# Altium project Environmental Sensor Shield.PrjPcb
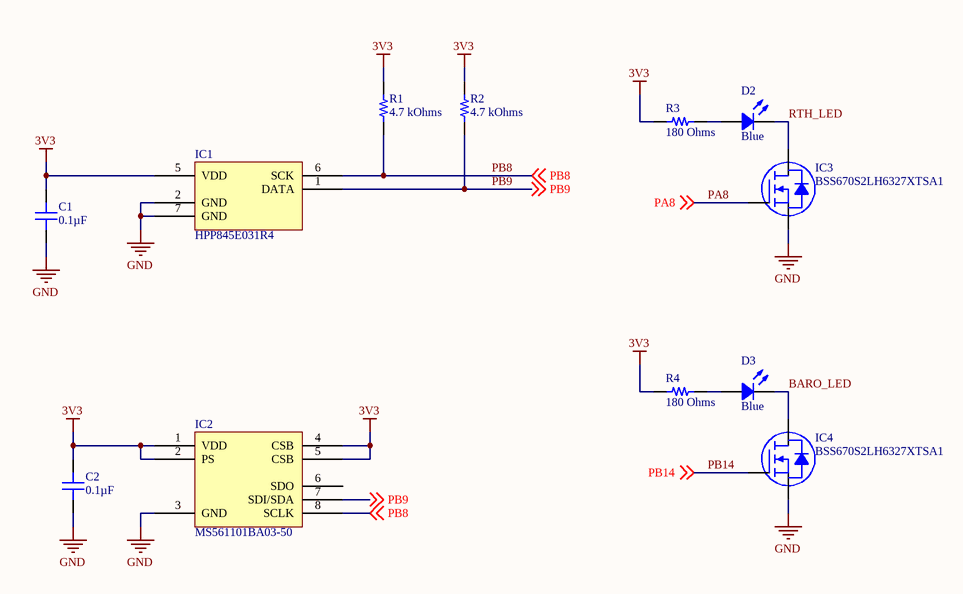
[diagram p0: Environmental Sensor.SchDoc]
3 sheets, 28 parts. Net scope: global (net labels, ports and power ports of the same name join across sheets).
Board file: Environmental Shield.PcbDoc
Sheets:
  Environmental Sensor.SchDoc
  Display Module.SchDoc
  Connectors.SchDoc

## Sheet Environmental Sensor.SchDoc: Environmental Sensor
size A4; SheetNumber: 1; SheetTotal: 3

### Parts
C1  0.1µF  [CAP 0603_1608]
C2  0.1µF  [CAP 0603_1608]
D2  Blue  [LED 0603_1608 BLUE]
D3  Blue  [LED 0603_1608 BLUE]
IC1  HPP845E031R4  [TE HPP845E031R4]
IC2  MS561101BA03-50  [MEAS SPEC MS5611-01BA03]
IC3  BSS670S2LH6327XTSA1  [INFINEON SOT-23-3]
IC4  BSS670S2LH6327XTSA1  [INFINEON SOT-23-3]
R1  4.7 kOhms  [RES 0603_1608]
R2  4.7 kOhms  [RES 0603_1608]
R3  180 Ohms  [RES 0603_1608]
R4  180 Ohms  [RES 0603_1608]

### Nets
3V3: C1.2 C2.2 IC1.5(VDD) IC2.1(VDD) IC2.2(PS) IC2.4(CSB) IC2.5(CSB) R1.2 R2.2 R3.1 R4.1
GND: C1.1 C2.1 IC1.2(GND) IC1.7(GND) IC2.3(GND) IC3.2(S) IC4.2(S)
BARO_LED: D3.2 IC4.3(D)
PA8: IC3.1(G) ; off-sheet PA8
PB8: IC1.6(SCK) IC2.8(SCLK) R1.1 ; off-sheet PB8
PB9: IC1.1(DATA) IC2.7(SDI/SDA) R2.1 ; off-sheet PB9
PB14: IC4.1(G) ; off-sheet PB14
RTH_LED: D2.2 IC3.3(D)
NetD2_1: D2.1 R3.2
NetD3_1: D3.1 R4.2

Not connected (* = marked no-connect by the designer): IC2 6(SDO)

### Notes on the sheet
- Title
- Size:
- Date:
- A4
- Number:
- Time:
- Revision:
- Sheet
- of
- File:

### Library data of the parts
C1 C2 = 06035C104JAT4A: CAP CER 0.1UF 50V X7R 0603; Manufacturer: AVX Corporation; Tolerance: ±5%; Part Number: 06035C104JAT4A; Value: 0.1µF; Applications: General Purpose; Capacitance: 0.1µF; ComponentLink1Description: Datasheet; ComponentLink1URL: http://datasheets.avx.com/X7RDielectric.pdf; ComponentLink2Description: DigiKey Link; ComponentLink2URL: http://digikey.com/product-detail/en/avx-corporation/06035C104JAT4A/478-12459-1-ND/9749311; Device Package: 0603 (1608 Metric); LastUpdated: 02/09/2020 01:03:34; Lifecycle Status: Active; Minimum Order: 1; Mounting Type: Surface Mount, MLCC; Operating Temperature: -55°C ~ 125°C; Package / Case: 0603 (1608 Metric); Packaging: TapeAndReel; PartId: 3002; Part Status: Active; Price: 0.01; Series: -; Size / Dimension: 0.063" L x 0.032" W (1.60mm x 0.81mm); Supplier 1: DigiKey; Supplier Part Number 1: 478-12459-1-ND; Temperature Coefficient: X7R; Thickness (Max): 0.035" (0.90mm); Voltage - Rated: 50V
D2 D3 = LTST-C193TBKT-5A: LED BLUE CLEAR CHIP SMD; Manufacturer: Lite-On Inc.; Configuration: Standard; Current - Test: 5mA; Lens Color: Colorless; Lens Size: 1.15mm x 0.80mm; Lens Style: Rectangle with Flat Top; Millicandela Rating: 15mcd; Viewing Angle: 130°; Voltage - Forward (Vf) (Typ): 2.8V; Wavelength - Dominant: 470nm; Wavelength - Peak: 468nm; Part Number: LTST-C193TBKT-5A; Color: Blue; ComponentLink1Description: Datasheet; ComponentLink1URL: //media.digikey.com/pdf/Data%20Sheets/Lite-On%20PDFs/LTST-C193TBKT-5A.pdf; ComponentLink2Description: DigiKey Link; ComponentLink2URL: http://digikey.com/product-detail/en/lite-on-inc/LTST-C193TBKT-5A/160-1827-1-ND/2355044; Device Package: 0603 (1608 Metric); Height (Max): 0.45mm; LastUpdated: 02/09/2020 01:20:25; Lens Transparency: Clear; Lifecycle Status: Active; Minimum Order: 1; Mounting Type: Surface Mount; Package / Case: 0603 (1608 Metric); Packaging: TapeAndReel; PartId: 829; Part Status: Active; Price: 0.06; Series: -; Size / Dimension: 1.60mm L x 0.80mm W; Supplier 1: DigiKey; Supplier Part Number 1: 160-1827-1-ND; Supplier Device Package: Chip LED; Value: Blue
IC1 = HPP845E031R4: SENSOR HUMID/TEMP 3V I2C 2% SMD; Manufacturer: TE Connectivity Measurement Specialties; Accuracy: ±2% RH; Humidity Range: 0 ~ 100% RH; Output: 12b; Output Type: I²C; Response Time: 5s; Sensor Type: Humidity, Temperature; Voltage - Supply: 1.5V ~ 3.6V; Part Number: HPP845E031R4; ComponentLink1Description: Datasheet; ComponentLink1URL: https://www.te.com/commerce/DocumentDelivery/DDEController?Action=srchrtrv&DocNm=HPC199_6&DocType=Data+Sheet&DocLang=English; ComponentLink2Description: DigiKey Link; ComponentLink2URL: http://digikey.com/product-detail/en/te-connectivity-measurement-specialties/HPP845E031R4/223-1144-1-ND/3945773; Device Package: 6-VDFN Exposed Pad; LastUpdated: 24/05/2020 22:55:13; Lifecycle Status: Active; Minimum Order: 1; Mounting Type: Surface Mount; Operating Temperature: -40°C ~ 125°C; Package / Case: 6-VDFN Exposed Pad; Packaging: TapeAndReel; Part Status: Active; Price: 2.87; Series: HTU; Supplier 1: DigiKey; Supplier Part Number 1: 223-1144-1-ND; Supplier Device Package: 6-DFN (3x3)
IC2 = MS561101BA03-50: BAROMETRIC PRESSURE SENSOR; Manufacturer: TE Connectivity Measurement Specialties; Accuracy: ±0.022PSI (±0.15kPa); Maximum Pressure: 87.02PSI (600kPa); Operating Pressure: 0.15PSI ~ 17.4PSI (1kPa ~ 120kPa); Output: 24 b; Output Type: I²C, SPI; Port Style: No Port; Pressure Type: Absolute; Voltage - Supply: 1.8V ~ 3.6V; Part Number: MS561101BA03-50; Applications: Board Mount; ComponentLink1Description: Datasheet; ComponentLink1URL: https://www.te.com/commerce/DocumentDelivery/DDEController?Action=srchrtrv&DocNm=MS5611-01BA03&DocType=Data+Sheet&DocLang=English; ComponentLink2Description: DigiKey Link; ComponentLink2URL: http://digikey.com/product-detail/en/te-connectivity-measurement-specialties/MS561101BA03-50/223-1622-1-ND/5277638; Device Package: 8-SMD; LastUpdated: 20/04/2020 15:54:53; Lifecycle Status: Active; Minimum Order: 1; Operating Temperature: -40°C ~ 85°C; Package / Case: 8-SMD; Packaging: Unknown; Part Status: Active; Price: 6.37; Series: -; Supplier 1: DigiKey; Supplier Part Number 1: 223-1622-1-ND; Termination Style: SMD (SMT) Tab
IC3 IC4 = BSS670S2LH6327XTSA1: MOSFET N-CH 55V 540MA SOT23; Manufacturer: Infineon Technologies; Current - Continuous Drain (Id) @ 25°C: 540mA (Ta); Drive Voltage (Max Rds On,  Min Rds On): 4.5V, 10V; FET Type: N-Channel; Gate Charge (Qg) (Max) @ Vgs: 2.26nC @ 10V; Input Capacitance (Ciss) (Max) @ Vds: 75pF @ 25V; Power Dissipation (Max): 360mW (Ta); Rds On (Max) @ Id, Vgs: 650mOhm @ 270mA, 10V; Vgs (Max): ±20V; Vgs(th) (Max) @ Id: 2V @ 2.7µA; Part Number: BSS670S2LH6327XTSA1; ComponentLink1Description: Datasheet; ComponentLink1URL: https://www.infineon.com/dgdl/BSS670S2L_Rev2.5.pdf?folderId=db3a3043156fd573011622e10b5c1f67&fileId=db3a304330f68606013109e4a7fb0094; ComponentLink2Description: DigiKey Link; ComponentLink2URL: http://digikey.com/product-detail/en/infineon-technologies/BSS670S2LH6327XTSA1/BSS670S2LH6327XTSA1CT-ND/3196653; Drain to Source Voltage (Vdss): 55V; LastUpdated: 02/09/2020 01:25:05; Lifecycle Status: Active; Minimum Order: 1; Mounting Type: Surface Mount; Operating Temperature: -55°C ~ 150°C (TJ); Package / Case: TO-236-3, SC-59, SOT-23-3; Packaging: TapeAndReel; Part Status: Active; Price: 0.07; Series: OptiMOS™; Supplier 1: DigiKey; Supplier Part Number 1: BSS670S2LH6327XTSA1CT-ND; Supplier Device Package: SOT-23-3; Technology: MOSFET (Metal Oxide)
R1 R2 = ERJ-3EKF4701V: RES SMD 4.7K OHM 1% 1/10W 0603; Manufacturer: Panasonic Electronic Components; Power (Watts): 0.1W, 1/10W; Temperature Coefficient: ±100ppm/°C; Part Number: ERJ-3EKF4701V; Value: 4.7 kOhms; ComponentLink1Description: Datasheet; ComponentLink1URL: https://industrial.panasonic.com/cdbs/www-data/pdf/RDA0000/AOA0000C304.pdf; ComponentLink2Description: DigiKey Link; ComponentLink2URL: http://digikey.com/product-detail/en/panasonic-electronic-components/ERJ-3EKF4701V/P4.70KHCT-ND/1746782; Composition: Thick Film; Device Package: 0603 (1608 Metric); Features: Automotive AEC-Q200; Height - Seated (Max): 0.022" (0.55mm); LastUpdated: 02/09/2020 01:10:23; Lifecycle Status: Active; Minimum Order: 1; Number of Terminations: 2; Operating Temperature: -55°C ~ 155°C; Package / Case: 0603 (1608 Metric); Packaging: TapeAndReel; PartId: 5645; Part Status: Active; Price: 0.01; Ratings: AEC-Q200; Resistance: 4.7 kOhms; Series: ERJ; Size / Dimension: 0.063" L x 0.031" W (1.60mm x 0.80mm); Supplier 1: DigiKey; Supplier Part Number 1: P4.70KHCT-ND; Supplier Device Package: 0603; Tolerance: ±1%
R3 R4 = ERJ-PA3J181V: RES SMD 180 OHM 5% 1/4W 0603; Manufacturer: Panasonic Electronic Components; Power (Watts): 0.25W, 1/4W; Temperature Coefficient: ±200ppm/°C; Part Number: ERJ-PA3J181V; Value: 180 Ohms; ComponentLink1Description: Datasheet; ComponentLink1URL: https://industrial.panasonic.com/cdbs/www-data/pdf/RDO0000/AOA0000C331.pdf; ComponentLink2Description: DigiKey Link; ComponentLink2URL: http://digikey.com/product-detail/en/panasonic-electronic-components/ERJ-PA3J181V/P180BZCT-ND/5036266; Composition: Thick Film; Device Package: 0603 (1608 Metric); Features: Automotive AEC-Q200, Pulse Withstanding; Height - Seated (Max): 0.022" (0.55mm); LastUpdated: 02/09/2020 01:09:49; Lifecycle Status: Active; Minimum Order: 1; Number of Terminations: 2; Operating Temperature: -55°C ~ 155°C; Package / Case: 0603 (1608 Metric); Packaging: TapeAndReel; PartId: 21551; Part Status: Active; Price: 0.01; Ratings: AEC-Q200; Resistance: 180 Ohms; Series: ERJ; Size / Dimension: 0.063" L x 0.031" W (1.60mm x 0.80mm); Supplier 1: DigiKey; Supplier Part Number 1: P180BZCT-ND; Supplier Device Package: 0603; Tolerance: ±5%

## Sheet Display Module.SchDoc: Display
size A4; SheetNumber: 2; SheetTotal: 3
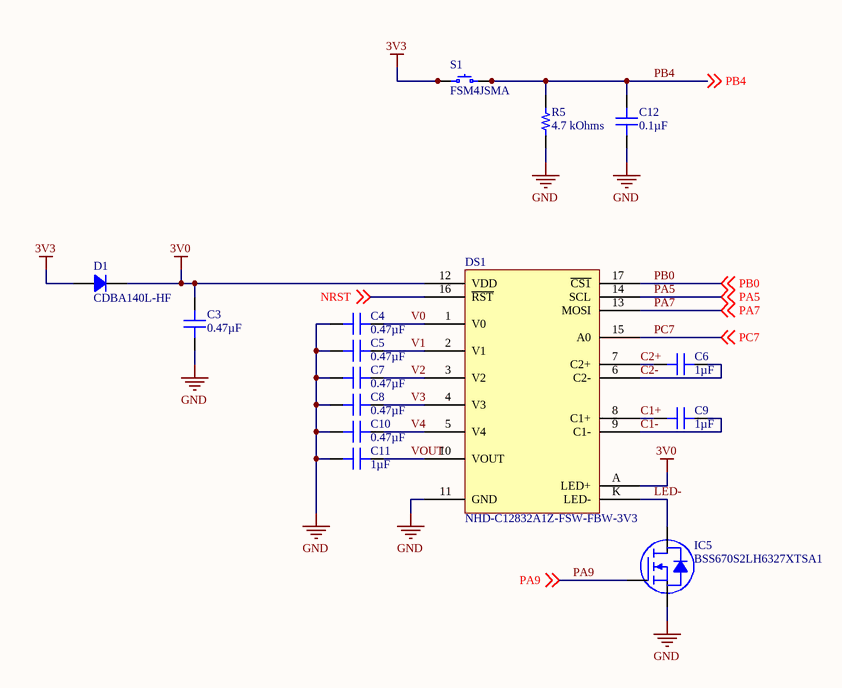
[diagram p1: Display Module.SchDoc]

### Parts
C3  0.47µF  [CAP 0603_1608]
C4  0.47µF  [CAP 0603_1608]
C5  0.47µF  [CAP 0603_1608]
C6  1µF  [CAP 0603_1608]
C7  0.47µF  [CAP 0603_1608]
C8  0.47µF  [CAP 0603_1608]
C9  1µF  [CAP 0603_1608]
C10  0.47µF  [CAP 0603_1608]
C11  1µF  [CAP 0603_1608]
C12  0.1µF  [CAP 0603_1608]
D1  CDBA140L-HF  [DO214AC SMA]
DS1  NHD-C12832A1Z-FSW-FBW-3V3  [NHD-C12832A1Z WHITE]
IC5  BSS670S2LH6327XTSA1  [INFINEON SOT-23-3]
R5  4.7 kOhms  [RES 0603_1608]
S1  FSM4JSMA  [TE FSM4JSMA]

### Nets
3V0: C3.1 D1.2 DS1.12(VDD) DS1.A(LED+)
3V3: D1.1 S1.1 S1.2
GND: C3.2 C4.2 C5.2 C7.2 C8.2 C10.2 C11.1 C12.1 DS1.11(GND) IC5.2(S) R5.1
C1+: C9.1 DS1.8(C1+)
C1-: C9.2 DS1.9(C1-)
C2+: C6.1 DS1.7(C2+)
C2-: C6.2 DS1.6(C2-)
LED-: DS1.K(LED-) IC5.3(D)
NRST: DS1.16(~{RST}) ; off-sheet NRST
PA5: DS1.14(SCL) ; off-sheet PA5
PA7: DS1.13(MOSI) ; off-sheet PA7
PA9: IC5.1(G) ; off-sheet PA9
PB0: DS1.17(~{CS1}) ; off-sheet PB0
PB4: C12.2 R5.2 S1.3 S1.4 ; off-sheet PB4
PC7: DS1.15(A0) ; off-sheet PC7
V0: C4.1 DS1.1(V0)
V1: C5.1 DS1.2(V1)
V2: C7.1 DS1.3(V2)
V3: C8.1 DS1.4(V3)
V4: C10.1 DS1.5(V4)
VOUT: C11.2 DS1.10(VOUT)

### Notes on the sheet
- Title
- Size:
- Date:
- A4
- Number:
- Time:
- Revision:
- Sheet
- of
- File:

### Library data of the parts
C3-C5 C7 C8 C10 = 0603B474K100CT: CAP CER 0.47UF 10V X7R 0603; Manufacturer: Walsin Technology Corporation; Tolerance: ±10%; Part Number: 0603B474K100CT; Value: 0.47µF; Applications: General Purpose; Capacitance: 0.47µF; ComponentLink1Description: Datasheet; ComponentLink1URL: http://www.passivecomponent.com/wp-content/uploads/2018/10/MLCC.pdf; ComponentLink2Description: DigiKey Link; ComponentLink2URL: http://digikey.com/product-detail/en/walsin-technology-corporation/0603B474K100CT/1292-1450-1-ND/9355454; Device Package: 0603 (1608 Metric); LastUpdated: 02/09/2020 01:03:16; Lifecycle Status: Active; Minimum Order: 1; Mounting Type: Surface Mount, MLCC; Operating Temperature: -55°C ~ 125°C; Package / Case: 0603 (1608 Metric); Packaging: TapeAndReel; PartId: 13392; Part Status: Active; Price: 0.01; Series: -; Size / Dimension: 0.063" L x 0.031" W (1.60mm x 0.80mm); Supplier 1: DigiKey; Supplier Part Number 1: 1292-1450-1-ND; Temperature Coefficient: X7R; Thickness (Max): 0.037" (0.95mm); Voltage - Rated: 10V
C6 C9 C11 = LMK107B7105KA-T: CAP CER 1UF 10V X7R 0603; Manufacturer: Taiyo Yuden; Tolerance: ±10%; Part Number: LMK107B7105KA-T; Value: 1µF; Applications: General Purpose; Capacitance: 1µF; ComponentLink1Description: Datasheet; ComponentLink1URL: https://www.yuden.co.jp/productdata/catalog/mlcc01_e.pdf; ComponentLink2Description: DigiKey Link; ComponentLink2URL: http://digikey.com/product-detail/en/taiyo-yuden/LMK107B7105KA-T/587-1242-1-ND/931019; Device Package: 0603 (1608 Metric); LastUpdated: 02/09/2020 01:03:30; Lifecycle Status: Active; Minimum Order: 1; Mounting Type: Surface Mount, MLCC; Operating Temperature: -55°C ~ 125°C; Package / Case: 0603 (1608 Metric); Packaging: TapeAndReel; PartId: 5525; Part Status: Active; Price: 0.01; Series: M; Size / Dimension: 0.063" L x 0.031" W (1.60mm x 0.80mm); Supplier 1: DigiKey; Supplier Part Number 1: 587-1242-1-ND; Temperature Coefficient: X7R; Thickness (Max): 0.035" (0.90mm); Voltage - Rated: 10V
C12 = 06035C104JAT4A: as C1 on sheet Environmental Sensor; Part Number: 06035C104JAT4A; Value: 0.1µF; Applications: General Purpose; Capacitance: 0.1µF; ComponentLink1Description: Datasheet; ComponentLink1URL: http://datasheets.avx.com/X7RDielectric.pdf; ComponentLink2Description: DigiKey Link; ComponentLink2URL: http://digikey.com/product-detail/en/avx-corporation/06035C104JAT4A/478-12459-1-ND/9749311; Device Package: 0603 (1608 Metric); LastUpdated: 02/09/2020 01:03:34; Lifecycle Status: Active; Minimum Order: 1; Mounting Type: Surface Mount, MLCC; Operating Temperature: -55°C ~ 125°C; Package / Case: 0603 (1608 Metric); Packaging: TapeAndReel; PartId: 3002; Part Status: Active; Price: 0.01; Series: -; Size / Dimension: 0.063" L x 0.032" W (1.60mm x 0.81mm); Supplier 1: DigiKey; Supplier Part Number 1: 478-12459-1-ND; Temperature Coefficient: X7R; Thickness (Max): 0.035" (0.90mm); Voltage - Rated: 50V
D1 = CDBA140L-HF: DIODE SCHOTTKY 40V 1A DO214AC; Manufacturer: Comchip Technology; Capacitance @ Vr, F: 130pF @ 4V, 1MHz; Current - Reverse Leakage @ Vr: 1mA @ 40V; Speed: Fast Recovery =< 500ns, > 200mA (Io); Voltage - Forward (Vf) (Max) @ If: 400mV @ 1A; Part Number: CDBA140L-HF; ComponentLink1Description: Datasheet; ComponentLink1URL: http://www.comchiptech.com/admin/files/product/CDBA140L-HF RevC513944.pdf; ComponentLink2Description: DigiKey Link; ComponentLink2URL: http://digikey.com/product-detail/en/comchip-technology/CDBA140L-HF/641-1691-1-ND/5226074; Current - Average Rectified (Io): 1A; Diode Type: Schottky; LastUpdated: 02/09/2020 01:19:02; Lifecycle Status: Active; Minimum Order: 1; Mounting Type: Surface Mount; Operating Temperature - Junction: -50°C ~ 100°C; Package / Case: DO-214AC, SMA; Packaging: TapeAndReel; PartId: 2148; Part Status: Active; Price: 0.10; Series: -; Supplier 1: DigiKey; Supplier Part Number 1: 641-1691-1-ND; Supplier Device Package: DO-214AC (SMA); Voltage - DC Reverse (Vr) (Max): 40V
DS1 = NHD-C12832A1Z-FSW-FBW-3V3: LCD COG GRAPHIC 128X32; Manufacturer: Newhaven Display Intl; Background Color: White (Black - Inverted); Backlight: LED - White; Display Mode: Transflective; Display Type: FSTN - Film Super-Twisted Nematic; Interface: SPI; Viewing Area: 36.00mm W x 12.00mm H; Part Number: NHD-C12832A1Z-FSW-FBW-3V3; ComponentLink1Description: Datasheet; ComponentLink1URL: http://www.newhavendisplay.com/specs/NHD-C12832A1Z-FSW-FBW-3V3.pdf; ComponentLink2Description: DigiKey Link; ComponentLink2URL: //digikey.com/product-detail/en/newhaven-display-intl/NHD-C12832A1Z-FSW-FBW-3V3/NHD-C12832A1Z-FSW-FBW-3V3-ND/2059236; LastUpdated: 04/12/2019 12:49:03; Lifecycle Status: 0; Minimum Order: 1; Packaging: Unknown; PartId: 1; Part Status: Active; Price: 11.53; Series: -; Supplier 1: DigiKey; Supplier Part Number 1: NHD-C12832A1Z-FSW-FBW-3V3-ND
IC5 = BSS670S2LH6327XTSA1: as IC3 on sheet Environmental Sensor; Part Number: BSS670S2LH6327XTSA1; ComponentLink1Description: Datasheet; ComponentLink1URL: https://www.infineon.com/dgdl/BSS670S2L_Rev2.5.pdf?folderId=db3a3043156fd573011622e10b5c1f67&fileId=db3a304330f68606013109e4a7fb0094; ComponentLink2Description: DigiKey Link; ComponentLink2URL: http://digikey.com/product-detail/en/infineon-technologies/BSS670S2LH6327XTSA1/BSS670S2LH6327XTSA1CT-ND/3196653; Drain to Source Voltage (Vdss): 55V; LastUpdated: 02/09/2020 01:25:05; Lifecycle Status: Active; Minimum Order: 1; Mounting Type: Surface Mount; Operating Temperature: -55°C ~ 150°C (TJ); Package / Case: TO-236-3, SC-59, SOT-23-3; Packaging: TapeAndReel; Part Status: Active; Price: 0.07; Series: OptiMOS™; Supplier 1: DigiKey; Supplier Part Number 1: BSS670S2LH6327XTSA1CT-ND; Supplier Device Package: SOT-23-3; Technology: MOSFET (Metal Oxide)
R5 = ERJ-3EKF4701V: as R1 on sheet Environmental Sensor; Part Number: ERJ-3EKF4701V; Value: 4.7 kOhms; ComponentLink1Description: Datasheet; ComponentLink1URL: https://industrial.panasonic.com/cdbs/www-data/pdf/RDA0000/AOA0000C304.pdf; ComponentLink2Description: DigiKey Link; ComponentLink2URL: http://digikey.com/product-detail/en/panasonic-electronic-components/ERJ-3EKF4701V/P4.70KHCT-ND/1746782; Composition: Thick Film; Device Package: 0603 (1608 Metric); Features: Automotive AEC-Q200; Height - Seated (Max): 0.022" (0.55mm); LastUpdated: 02/09/2020 01:10:23; Lifecycle Status: Active; Minimum Order: 1; Number of Terminations: 2; Operating Temperature: -55°C ~ 155°C; Package / Case: 0603 (1608 Metric); Packaging: TapeAndReel; PartId: 5645; Part Status: Active; Price: 0.01; Ratings: AEC-Q200; Resistance: 4.7 kOhms; Series: ERJ; Size / Dimension: 0.063" L x 0.031" W (1.60mm x 0.80mm); Supplier 1: DigiKey; Supplier Part Number 1: P4.70KHCT-ND; Supplier Device Package: 0603; Tolerance: ±1%
S1 = FSM4JSMA: SWITCH TACTILE SPST-NO 0.05A 24V; Manufacturer: TE Connectivity ALCOSWITCH Switches; Actuator Height off PCB, Vertical: 5.00mm; Actuator Orientation: Top Actuated; Actuator Type: Standard; Contact Rating @ Voltage: 0.05A @ 24VDC; Illumination: Non-Illuminated; Operating Force: 160gf; Outline: 6.00mm x 6.00mm; Switch Function: Off-Mom; Part Number: FSM4JSMA; Circuit: SPST-NO; ComponentLink1Description: Datasheet; ComponentLink1URL: https://www.te.com/commerce/DocumentDelivery/DDEController?Action=srchrtrv&DocNm=1308111-1_SWITCHES_CORE_PROGRAM_CATALOG&DocType=CS&DocLang=English; ComponentLink2Description: DigiKey Link; ComponentLink2URL: http://digikey.com/product-detail/en/te-connectivity-alcoswitch-switches/FSM4JSMA/450-1129-ND/525821; LastUpdated: 02/09/2020 01:27:07; Lifecycle Status: Active; Minimum Order: 1; Mounting Type: Surface Mount; Operating Temperature: -35°C ~ 85°C; Packaging: Bulk; Part Status: Active; Price: 0.23; Series: FSMJSMA; Supplier 1: DigiKey; Supplier Part Number 1: 450-1129-ND; Termination Style: Gull Wing

## Sheet Connectors.SchDoc
size A4; SheetNumber: 3; SheetTotal: 3
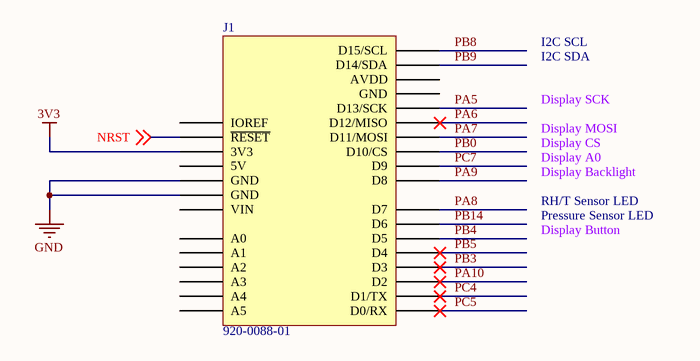
[diagram p2: Connectors.SchDoc]

### Parts
J1  920-0088-01  [SCHMARTBOARD - 920-0088-01]

### Nets
3V3: J1.4(3V3)
GND: J1.6(GND) J1.7(GND)
NRST: J1.3(~{RESET}) ; off-sheet NRST
PA5: J1.28(D13/SCK)
PA6: J1.27(D12/MISO)
PA7: J1.26(D11/MOSI)
PA8: J1.22(D7)
PA9: J1.23(D8)
PA10: J1.17(D2)
PB0: J1.25(D10/CS)
PB3: J1.18(D3)
PB4: J1.20(D5)
PB5: J1.19(D4)
PB8: J1.32(D15/SCL)
PB9: J1.31(D14/SDA)
PB14: J1.21(D6)
PC4: J1.16(D1/TX)
PC5: J1.15(D0/RX)
PC7: J1.24(D9)

Not connected (* = marked no-connect by the designer): J1 2(IOREF) 5(5V) 8(VIN) 9(A0) 10(A1) 11(A2) 12(A3) 13(A4) 14(A5) 29(GND) 30(AVDD)

### Notes on the sheet
- I2C SCL
- I2C SDA
- Display CS
- Display SCK
- Display MOSI
- Display A0
- Pressure Sensor LED
- Display Button
- Display Backlight
- RH/T Sensor LED

### Library data of the parts
J1 = 920-0088-01: CONN HDR 8/10P 0.1 GOLD PCB 6PC; Manufacturer: Schmartboard, Inc.; Connector Type: Header; Contact Length - Post: 0.413" (10.50mm); Number of Positions: 6, 8, 10; Number of Positions Loaded: All; Pitch - Mating: 0.100" (2.54mm); Style: Board to Board; System: Connector; Part Number: 920-0088-01; ComponentLink1Description: Datasheet; ComponentLink1URL: http://schmartboard.com/content/Brochures/920-0088-01.pdf; ComponentLink2Description: DigiKey Link; ComponentLink2URL: http://digikey.com/product-detail/en/schmartboard-inc/920-0088-01/1988-1036-ND/9559319; Contact Finish - Mating: Gold; Contact Finish - Post: Gold; Contact Type: Female Socket; Fastening Type: Push-Pull; Insulation Color: Black; Insulation Height: 0.335" (8.51mm); LastUpdated: 31/01/2020 20:49:58; Lifecycle Status: Active; Minimum Order: 1; Mounting Type: Through Hole; Number of Rows: 1; Packaging: Bulk; Part Status: Active; Price: 5.00; Series: -; Supplier 1: DigiKey; Supplier Part Number 1: 1988-1036-ND; Termination: Solder

## Nets that join several sheets
3V3: Environmental Sensor (11 pins), Display Module (D1.1 S1.1 S1.2), Connectors (J1.4)
GND: Environmental Sensor (7 pins), Display Module (11 pins), Connectors (J1.6 J1.7)
NRST: Display Module (DS1.16), Connectors (J1.3)
PA5: Display Module (DS1.14), Connectors (J1.28)
PA7: Display Module (DS1.13), Connectors (J1.26)
PA8: Environmental Sensor (IC3.1), Connectors (J1.22)
PA9: Display Module (IC5.1), Connectors (J1.23)
PB0: Display Module (DS1.17), Connectors (J1.25)
PB4: Display Module (C12.2 R5.2 S1.3 S1.4), Connectors (J1.20)
PB8: Environmental Sensor (IC1.6 IC2.8 R1.1), Connectors (J1.32)
PB9: Environmental Sensor (IC1.1 IC2.7 R2.1), Connectors (J1.31)
PB14: Environmental Sensor (IC4.1), Connectors (J1.21)
PC7: Display Module (DS1.15), Connectors (J1.24)